# Altium project Merge.PrjPcb
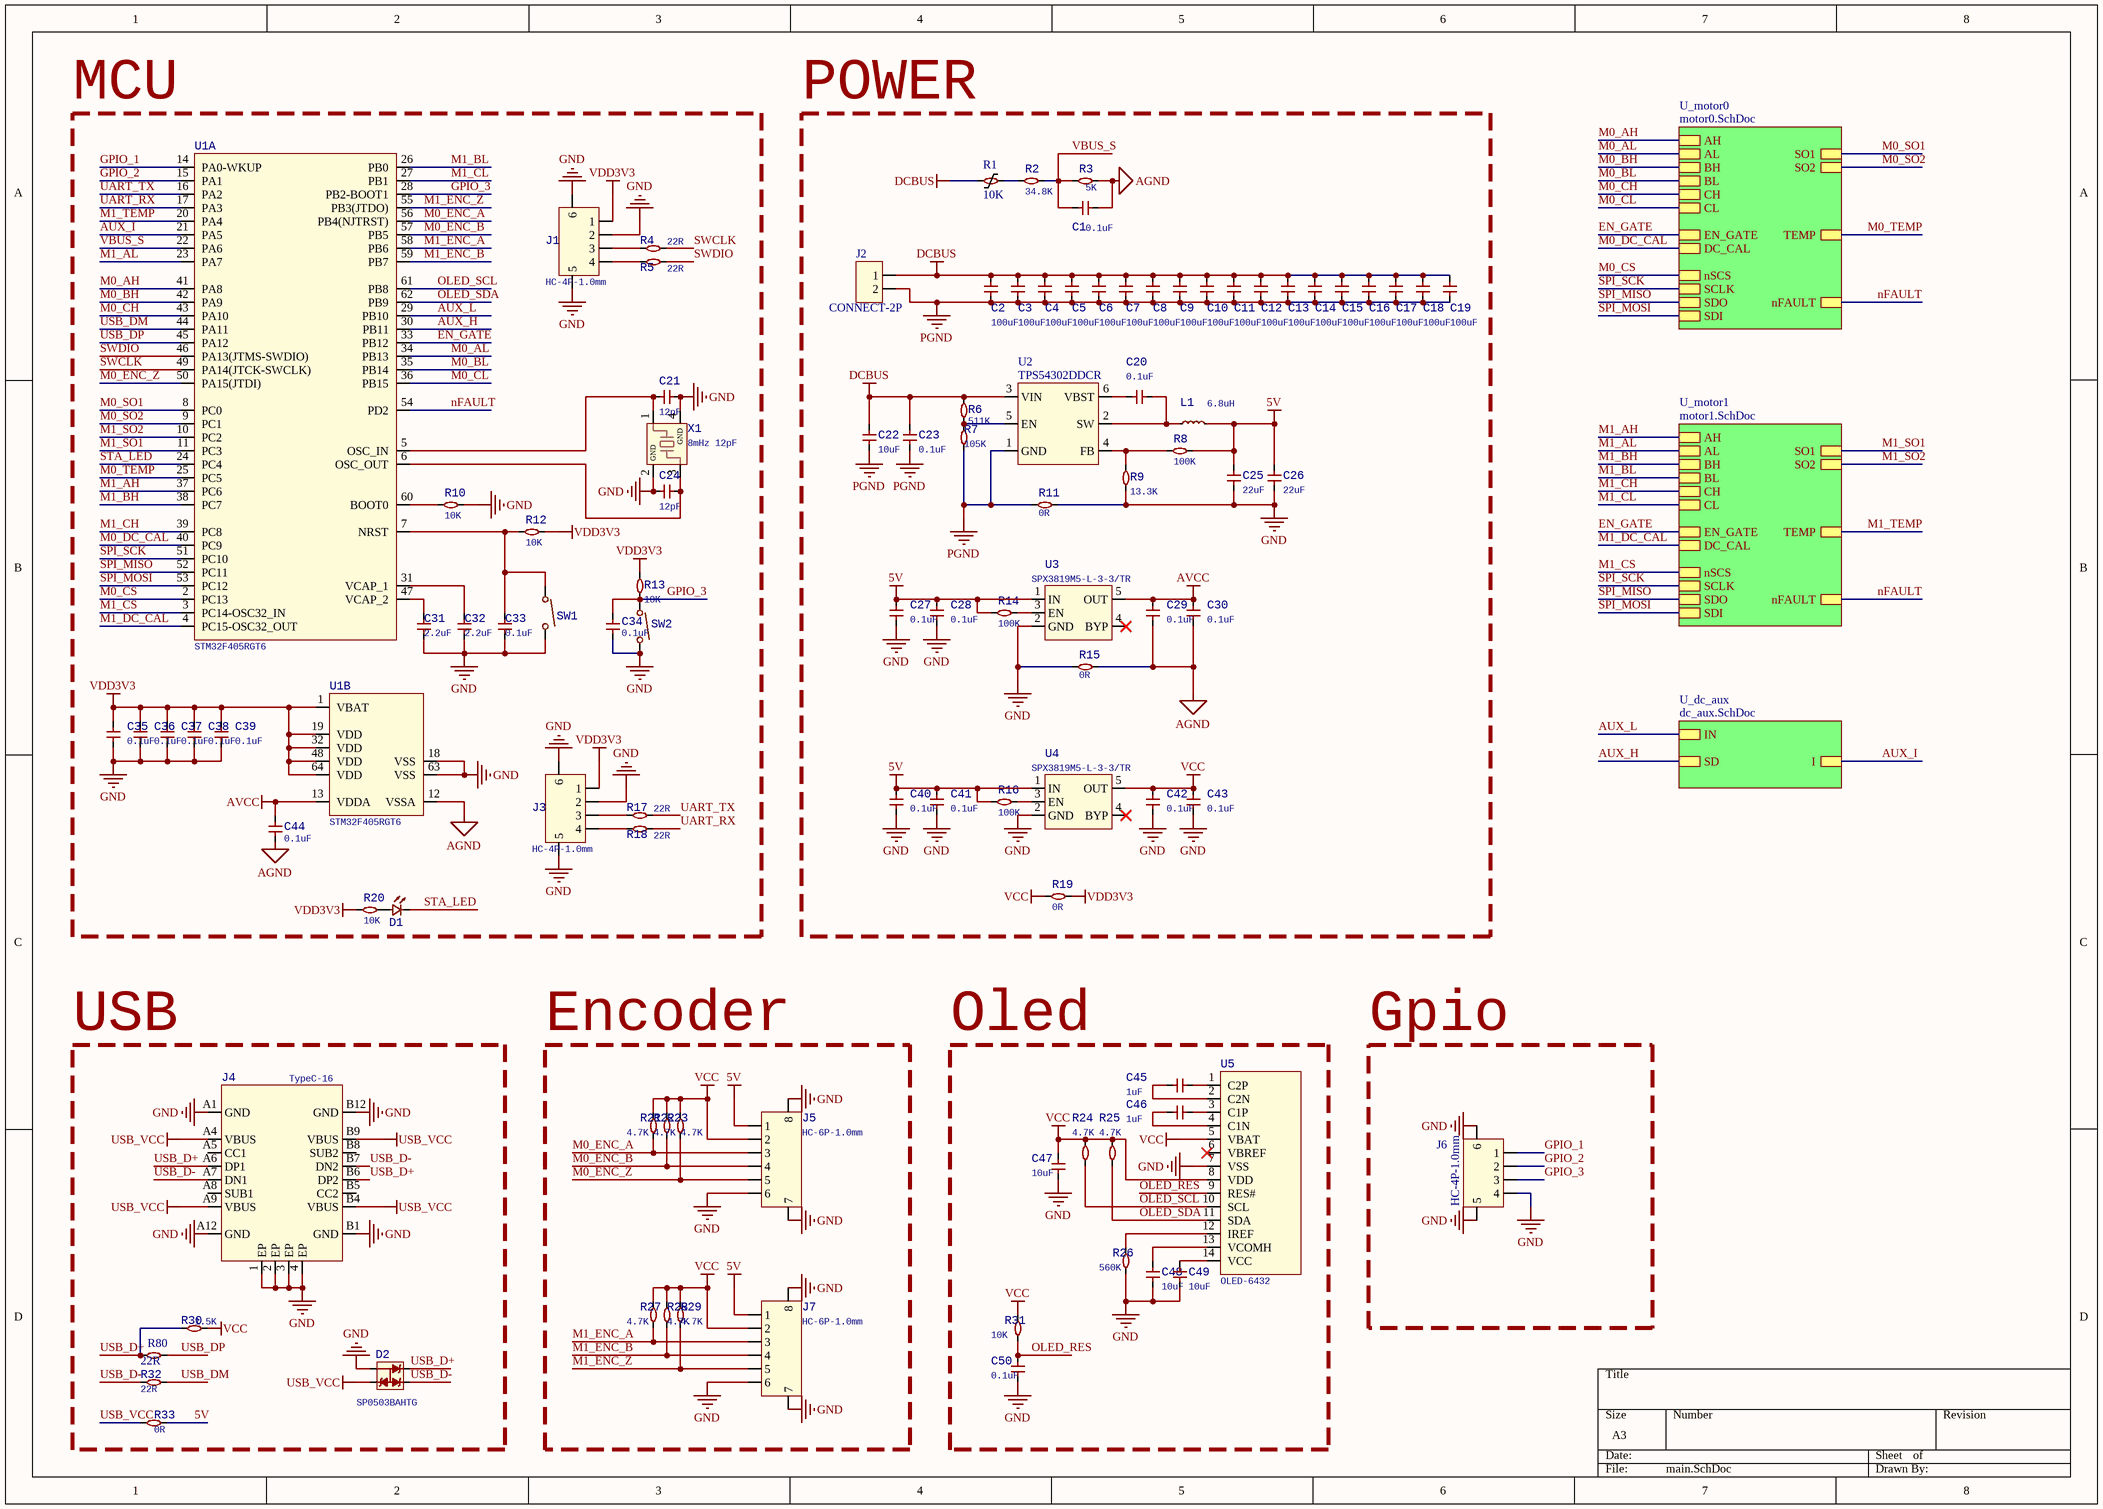
[diagram p0: main.SchDoc]
4 sheets, 219 parts. Net scope: hierarchical (ports join the sheet entries above them; power ports are global).
Board file: focDriver.PcbDoc
Sheets:
  main.SchDoc
    U_motor1 = motor1.SchDoc
    U_motor0 = motor0.SchDoc
    U_dc_aux = dc_aux.SchDoc

## Sheet main.SchDoc
size A3; SheetNumber: 1; SheetTotal: 4

### Parts
C1  0.1uF  [C0402]
C2  100uF  [C1206]
C3  100uF  [C1206]
C4  100uF  [C1206]
C5  100uF  [C1206]
C6  100uF  [C1206]
C7  100uF  [C1206]
C8  100uF  [C1206]
C9  100uF  [C1206]
C10  100uF  [C1206]
C11  100uF  [C1206]
C12  100uF  [C1206]
C13  100uF  [C1206]
C14  100uF  [C1206]
C15  100uF  [C1206]
C16  100uF  [C1206]
C17  100uF  [C1206]
C18  100uF  [C1206]
C19  100uF  [C1206]
C20  0.1uF  [C0402]
C21  12pF  [C0402]
C22  10uF  [C0402]
C23  0.1uF  [C0402]
C24  12pF  [C0402]
C25  22uF  [C0805]
C26  22uF  [C0805]
C27  0.1uF  [C0402]
C28  0.1uF  [C0402]
C29  0.1uF  [C0402]
C30  0.1uF  [C0402]
C31  2.2uF  [C0402]
C32  2.2uF  [C0402]
C33  0.1uF  [C0402]
C34  0.1uF  [C0402]
C35  0.1uF  [C0402]
C36  0.1uF  [C0402]
C37  0.1uF  [C0402]
C38  0.1uF  [C0402]
C39  0.1uF  [C0402]
C40  0.1uF  [C0402]
C41  0.1uF  [C0402]
C42  0.1uF  [C0402]
C43  0.1uF  [C0402]
C44  0.1uF  [C0402]
C45  1uF  [C0402]
C46  1uF  [C0402]
C47  10uF  [C0402]
C48  10uF  [C0402]
C49  10uF  [C0402]
C50  0.1uF  [C0402]
D1  LED  [LED-0402]  (value not drawn)
D2  SP0503BAHTG  [SOT-143]
J1  HC-4P-1.0mm  [SMD_4P_HC-1.0]
J2  CONNECT-2P  [CONNECT--EP-2P]
J3  HC-4P-1.0mm  [SMD_4P_HC-1.0]
J4  TypeC-16  [USB-SMD_TYPE-C-16P]
J5  HC-6P-1.0mm  [SMD_6P_HC-1.0]
J6  HC-4P-1.0mm  [SMD_4P_HC-1.0]
J7  HC-6P-1.0mm  [SMD_6P_HC-1.0]
L1  6.8uH  [L1008]
R1  10K  [R0402]
R2  34.8K  [R0402]
R3  5K  [R0402]
R4  22R  [R0402]
R5  22R  [R0402]
R6  511K  [R0402]
R7  105K  [R0402]
R8  100K  [R0402]
R9  13.3K  [R0402]
R10  10K  [R0402]
R11  0R  [R0402]
R12  10K  [R0402]
R13  10K  [R0402]
R14  100K  [R0402]
R15  0R  [R0402]
R16  100K  [R0402]
R17  22R  [R0402]
R18  22R  [R0402]
R19  0R  [R0402]
R20  10K  [R0402]
R21  4.7K  [R0402]
R22  4.7K  [R0402]
R23  4.7K  [R0402]
R24  4.7K  [R0402]
R25  4.7K  [R0402]
R26  560K  [R0402]
R27  4.7K  [R0402]
R28  4.7K  [R0402]
R29  4.7K  [R0402]
R30  1.5K  [R0402]
R31  10K  [R0402]
R32  22R  [R0402]
R33  0R  [R0402]
R80  22R  [R0402]
SW1  3*4两脚按键  [SW-SMD_L4.0-W2.9]  (value not drawn)
SW2  3*4两脚按键  [SW-SMD_L4.0-W2.9]  (value not drawn)
U1  STM32F405RGT6  [LQFP-64_L10.0-W10.0-P0.50]  (parts A,B of 2)
U2  TPS54302DDCR  [SOT-23-6]
U3  SPX3819M5-L-3-3/TR  [SOT-23-5]
U4  SPX3819M5-L-3-3/TR  [SOT-23-5]
U5  OLED-6432  [OLED-0.96-128x64]
X1  8mHz 12pF  [SMD2016-4P]

### Blocks framed on the sheet
MCU: C21 C24 C31-C39 C44 D1 J1 J3 R4 R5 R10 R12 R13 R17 R18 R20 SW1 SW2 U1 X1
POWER: C1-C20 C22 C23 C25-C30 C40-C43 J2 L1 R1-R3 R6-R9 R11 R14-R16 R19 U2-U4
USB: D2 J4 R30 R32 R33 R80
Encoder: J5 J7 R21-R23 R27-R29
Oled: C45-C50 R24-R26 R31 U5
Gpio: J6

### Sub-sheets
U_dc_aux = dc_aux.SchDoc: IN, SD, I
U_motor0 = motor0.SchDoc: SO2, CL, SO1, CH, BL, BH, AL, AH, EN_GATE, DC_CAL, SCLK, SDO, SDI, nSCS, nFAULT, TEMP
U_motor1 = motor1.SchDoc: SO2, CL, SO1, CH, BL, BH, AL, AH, EN_GATE, DC_CAL, SCLK, SDO, SDI, nSCS, nFAULT, TEMP

### Nets
5V: C25.1 C26.1 C27.1 C28.1 C40.1 C41.1 J5.1 J7.1 L1.2 R8.2 R14.2 R16.2 R33.2 U3.1(IN) U4.1(IN)
AGND: C1.2 C29.2 C30.2 C44.2 R3.1 R15.1 U1.12(VSSA)
AVCC: C29.1 C30.1 C44.1 U1.13(VDDA) U3.5(OUT)
DCBUS: C2.1 C3.1 C4.1 C5.1 C6.1 C7.1 C8.1 C9.1 C10.1 C11.1 C12.1 C13.1 C14.1 C15.1 C16.1 C17.1 C18.1 C19.1 C22.1 C23.1 J2.1 R1.2 R6.2 U2.3(VIN)
GND: C21.2 C24.2 C25.2 C26.2 C27.2 C28.2 C31.2 C32.2 C33.1 C34.1 C35.2 C36.2 C37.2 C38.2 C39.2 C40.2 C41.2 C42.2 C43.2 C47.2 C48.2 C49.2 C50.2 D2.1 J1.2 J1.5 J1.6 J3.2 J3.5 J3.6 J4.1(EP) J4.2(EP) J4.3(EP) J4.4(EP) J4.A1(GND) J4.A12(GND) J4.B1(GND) J4.B12(GND) J5.6 J5.7 J5.8 J6.4 J6.5 J6.6 J7.6 J7.7 J7.8 R9.1 R10.2 R11.1 R15.2 R26.1 SW1.2 SW2.2 U1.18(VSS) U1.63(VSS) U3.2(GND) U4.2(GND) U5.7(VSS) X1.2(GND) X1.4(GND)
PGND: C2.2 C3.2 C4.2 C5.2 C6.2 C7.2 C8.2 C9.2 C10.2 C11.2 C12.2 C13.2 C14.2 C15.2 C16.2 C17.2 C18.2 C19.2 C22.2 C23.2 J2.2 R7.2 R11.2 U2.1(GND)
USB_VCC: D2.2 J4.A4(VBUS) J4.A9(VBUS) J4.B4(VBUS) J4.B9(VBUS) R33.1
VCC: C42.1 C43.1 C47.1 J5.2 J7.2 R19.1 R21.2 R22.2 R23.2 R24.2 R25.2 R27.2 R28.2 R29.2 R30.2 R31.2 U4.5(OUT) U5.5(VBAT) U5.8(VDD)
VDD3V3: C35.1 C36.1 C37.1 C38.1 C39.1 J1.1 J3.1 R12.2 R13.2 R19.2 R20.1 U1.1(VBAT) U1.19(VDD) U1.32(VDD) U1.48(VDD) U1.64(VDD)
AUX_H: U1.30(PB11) ; sheet U_dc_aux/SD
AUX_I: U1.21(PA5) ; sheet U_dc_aux/I
AUX_L: U1.29(PB10) ; sheet U_dc_aux/IN
EN_GATE: U1.33(PB12) ; sheet U_motor1/EN_GATE, sheet U_motor0/EN_GATE
GPIO_1: J6.1 U1.14(PA0-WKUP)
GPIO_2: J6.2 U1.15(PA1)
GPIO_3: C34.2 J6.3 R13.1 SW2.1 U1.28(PB2-BOOT1)
M0_AH: U1.41(PA8) ; sheet U_motor0/AH
M0_AL: U1.34(PB13) ; sheet U_motor0/AL
M0_BH: U1.42(PA9) ; sheet U_motor0/BH
M0_BL: U1.35(PB14) ; sheet U_motor0/BL
M0_CH: U1.43(PA10) ; sheet U_motor0/CH
M0_CL: U1.36(PB15) ; sheet U_motor0/CL
M0_CS: U1.2(PC13) ; sheet U_motor0/nSCS
M0_DC_CAL: U1.40(PC9) ; sheet U_motor0/DC_CAL
M0_ENC_A: J5.3 R21.1 U1.56(PB4(NJTRST))
M0_ENC_B: J5.4 R22.1 U1.57(PB5)
M0_ENC_Z: J5.5 R23.1 U1.50(PA15(JTDI))
M0_SO1: U1.8(PC0) ; sheet U_motor0/SO1
M0_SO2: U1.9(PC1) ; sheet U_motor0/SO2
M0_TEMP: U1.25(PC5) ; sheet U_motor0/TEMP
M1_AH: U1.37(PC6) ; sheet U_motor1/AH
M1_AL: U1.23(PA7) ; sheet U_motor1/AL
M1_BH: U1.38(PC7) ; sheet U_motor1/BH
M1_BL: U1.26(PB0) ; sheet U_motor1/BL
M1_CH: U1.39(PC8) ; sheet U_motor1/CH
M1_CL: U1.27(PB1) ; sheet U_motor1/CL
M1_CS: U1.3(PC14-OSC32_IN) ; sheet U_motor1/nSCS
M1_DC_CAL: U1.4(PC15-OSC32_OUT) ; sheet U_motor1/DC_CAL
M1_ENC_A: J7.3 R27.1 U1.58(PB6)
M1_ENC_B: J7.4 R28.1 U1.59(PB7)
M1_ENC_Z: J7.5 R29.1 U1.55(PB3(JTDO))
M1_SO1: U1.11(PC3) ; sheet U_motor1/SO1
M1_SO2: U1.10(PC2) ; sheet U_motor1/SO2
M1_TEMP: U1.20(PA4) ; sheet U_motor1/TEMP
nFAULT: U1.54(PD2) ; sheet U_motor1/nFAULT, sheet U_motor0/nFAULT
OLED_RES: C50.1 R31.1 U5.9(RES#)
OLED_SCL: R24.1 U1.61(PB8) U5.10(SCL)
OLED_SDA: R25.1 U1.62(PB9) U5.11(SDA)
SPI_MISO: U1.52(PC11) ; sheet U_motor1/SDO, sheet U_motor0/SDO
SPI_MOSI: U1.53(PC12) ; sheet U_motor1/SDI, sheet U_motor0/SDI
SPI_SCK: U1.51(PC10) ; sheet U_motor1/SCLK, sheet U_motor0/SCLK
STA_LED: D1.1 U1.24(PC4)
SWCLK: R4.2 U1.49(PA14(JTCK-SWCLK))
SWDIO: R5.2 U1.46(PA13(JTMS-SWDIO))
UART_RX: R18.2 U1.17(PA3)
UART_TX: R17.2 U1.16(PA2)
USB_D+: D2.4 J4.A6(DP1) J4.B6(DP2) R30.1 R80.1
USB_D-: D2.3 J4.A7(DN1) J4.B7(DN2) R32.1
USB_DM: R32.2 U1.44(PA11)
USB_DP: R80.2 U1.45(PA12)
VBUS_S: C1.1 R2.1 R3.2 U1.22(PA6)
NetC20_1: C20.1 L1.1 U2.2(SW)
NetC20_2: C20.2 U2.6(VBST)
NetC21_1: C21.1 U1.5(OSC_IN) X1.1
NetC24_1: C24.1 U1.6(OSC_OUT) X1.3
NetC31_1: C31.1 U1.47(VCAP_2)
NetC32_1: C32.1 U1.31(VCAP_1)
NetC33_2: C33.2 R12.1 SW1.1 U1.7(NRST)
NetC45_1: C45.1 U5.1(C2P)
NetC45_2: C45.2 U5.2(C2N)
NetC46_1: C46.1 U5.3(C1P)
NetC46_2: C46.2 U5.4(C1N)
NetC48_1: C48.1 U5.13(VCOMH)
NetC49_1: C49.1 U5.14(VCC)
NetD1_2: D1.2 R20.2
NetJ1_3: J1.3 R4.1
NetJ1_4: J1.4 R5.1
NetJ3_3: J3.3 R17.1
NetJ3_4: J3.4 R18.1
NetR1_1: R1.1 R2.2
NetR6_1: R6.1 R7.1 U2.5(EN)
NetR8_1: R8.1 R9.2 U2.4(FB)
NetR10_1: R10.1 U1.60(BOOT0)
NetR14_1: R14.1 U3.3(EN)
NetR16_1: R16.1 U4.3(EN)
NetR26_2: R26.2 U5.12(IREF)

Not connected (* = marked no-connect by the designer): J4 A5(CC1) A8(SUB1) B5(CC2) B8(SUB2); U3 4(BYP)*; U4 4(BYP)*; U5 6(VBREF)*

### Library data of the parts
C1-C50 = CAP: 贴片电容; Manufacturer: SAMSUNG(三星); Manufacturer Part: CL05A105KP5NNND; Add into BOM: yes; Tolerance: ±10%; Voltage Rated: 10V; Temperature Coefficient: X5R; Symbol: CAP-0402; Device: cap-0402; LCSC Part Name: 1uF ±10% 10V; Supplier Part: C307414; Supplier Footprint: 0402; JLCPCB Part Class: Extended Part; Datasheet: https://atta.szlcsc.com/upload/public/pdf/source/20181009/C307414_0A02B57115E94FED95F0CB1E32115BFC.pdf; Supplier: LCSC; Convert to PCB: yes
D1 = LED: 贴片发光二极管; Manufacturer: SAMSUNG(三星); Manufacturer Part: CL05A105KP5NNND; Add into BOM: yes; Tolerance: ±10%; Voltage Rated: 10V; Temperature Coefficient: X5R; Symbol: CAP-0402; Device: cap-0402; LCSC Part Name: 1uF ±10% 10V; Supplier Part: C307414; Supplier Footprint: 0402; JLCPCB Part Class: Extended Part; Datasheet: https://atta.szlcsc.com/upload/public/pdf/source/20181009/C307414_0A02B57115E94FED95F0CB1E32115BFC.pdf; Supplier: LCSC; Convert to PCB: yes
D2 = SP0503BAHTG: USB-三组 瞬态移植二极管
J1 J3 J6 = HC-4P-1.0mm: 线对板连接器
J2 = CONNECT-2P: 连接器
J4 = TypeC-16P: Type-C母座; 触点数量:16; Manufacturer: kinghelm(金航标); Symbol: KH-TYPE-C-16P; Add into BOM: yes; Connector Type: Type-C; Gender: 母座; Number of Contacts: 16; Number of Ports: 1; Current Rating - Power (Max): 3A; LCSC Part Name: Type-C 母座 卧贴; Supplier Part: C709357; Manufacturer Part: KH-TYPE-C-16P; Supplier Footprint: SMD; Datasheet: https://atta.szlcsc.com/upload/public/pdf/source/20200911/C709357_AA8DCEB38BB20E3035A7ED7AE7667837.pdf; Supplier: LCSC; Convert to PCB: yes; Standard: -; Mounting Style: 卧贴; Operating Temperature Range: -40~+85; JLCPCB Part Class: Extended Part
J5 J7 = HC-6P-1.0mm: 线对板连接器
L1 = IND: 贴片电感
R1 = NTC: 热敏电阻; Manufacturer: UNI-ROYAL(厚声); Manufacturer Part: 0402WGF1001TCE; Add into BOM: yes; Tolerance: ±1%; Power(Watts): 1/16W; Temperature Coefficient: ±100ppm/; Overload Voltage (Max): 50V; Symbol: RES-0402; Device: res-0402; LCSC Part Name: 1k ±1%; Supplier Part: C11702; Supplier Footprint: 0402; Datasheet: https://atta.szlcsc.com/upload/public/pdf/source/20200306/C422600_1E6D84923E4A46A82E41ADD87F860B5C.pdf; Supplier: LCSC; Convert to PCB: yes; Type: 厚膜电阻; Operating Temperature Range: -55~+155; JLCPCB Part Class: 基础库
R2-R33 R80 = RES: 贴片电阻; Manufacturer: UNI-ROYAL(厚声); Manufacturer Part: 0402WGF1001TCE; Add into BOM: yes; Tolerance: ±1%; Power(Watts): 1/16W; Temperature Coefficient: ±100ppm/; Overload Voltage (Max): 50V; Symbol: RES-0402; Device: res-0402; LCSC Part Name: 1k ±1%; Supplier Part: C11702; Supplier Footprint: 0402; Datasheet: https://atta.szlcsc.com/upload/public/pdf/source/20200306/C422600_1E6D84923E4A46A82E41ADD87F860B5C.pdf; Supplier: LCSC; Convert to PCB: yes; Type: 厚膜电阻; Operating Temperature Range: -55~+155; JLCPCB Part Class: 基础库
SW1 SW2 = Switch: 3*4两脚贴片不带柱; Manufacturer: BRIGHT(博瑞泰); Symbol: TSA343G00-250J2; Device: 3*4两脚按键不带柱; Add into BOM: yes; Contact Current: 50mA; Voltage Rating (DC): 12V; Insulation Resistance: 100M; Circuit: 单刀单掷; Actuator Style: 圆形按钮; Actuator/Cap Color: 黑色; With Lamp: 无; Operating Force: 250gf@±50gf; Mechanical Life: 50000; Pin Style: SMD接片; Switch Length: 3.95mm; Switch Width: 2.9mm; Switch Height: 2mm; Strike Gundam: 否; LCSC Part Name: 3*4 两脚小龟不带柱  250gf; Supplier Part: C354946; Manufacturer Part: TSA343G00-250J2; Supplier Footprint: SMD; Datasheet: https://atta.szlcsc.com/upload/public/pdf/source/20190426/C354946_6B70DFBDFA823D17B8EB46FB9599F693.pdf; Supplier: LCSC; Convert to PCB: yes; Mounting Style: 立贴; Operating Temperature: -25~+70; JLCPCB Part Class: Extended Part
U1 = STM32F405RGT6: ST,MCU,CPU内核：ARM Cortex-M4 CPU最大主频：168MHz 程序存储容量：512KB 程序存储器类型：FLASH RAM总容量：192KB
U2 = TPS54302DDCR: 降压DCDC / 输入4.5~28V / 输出596mV~28V / 3A
U3 U4 = SPX3819M5-L-3-3/TR: LDO输入电压:16V;输出电压:3.3V; Manufacturer: MaxLinear; Add into BOM: yes; Output Type: 固定; Output Polarity: 正; Number of Outputs: 1; Maximum Input Voltage: 16V; Output Voltage: 3.3V; Dropout Voltage: 700mV@(500mA); Output Current: 500mA; Power Supply Rejection Ratio (PRSS): 70dB; Symbol: SPX3819M5-L-3-3/TR; LCSC Part Name: Vin=16V Vout=3.3V 500mA 70dB; Supplier Part: C9055; Manufacturer Part: SPX3819M5-L-3-3/TR; Supplier Footprint: SOT-23-5; Datasheet: https://atta.szlcsc.com/upload/public/pdf/source/20160421/1461205045150.pdf; Supplier: LCSC; Convert to PCB: yes; JLCPCB Part Class: Extended Part
U5 = OLED
X1 = XTAL: 无源晶振  频率公差：±10ppm

## Sheet motor1.SchDoc
size A4; SheetNumber: 3; SheetTotal: 4
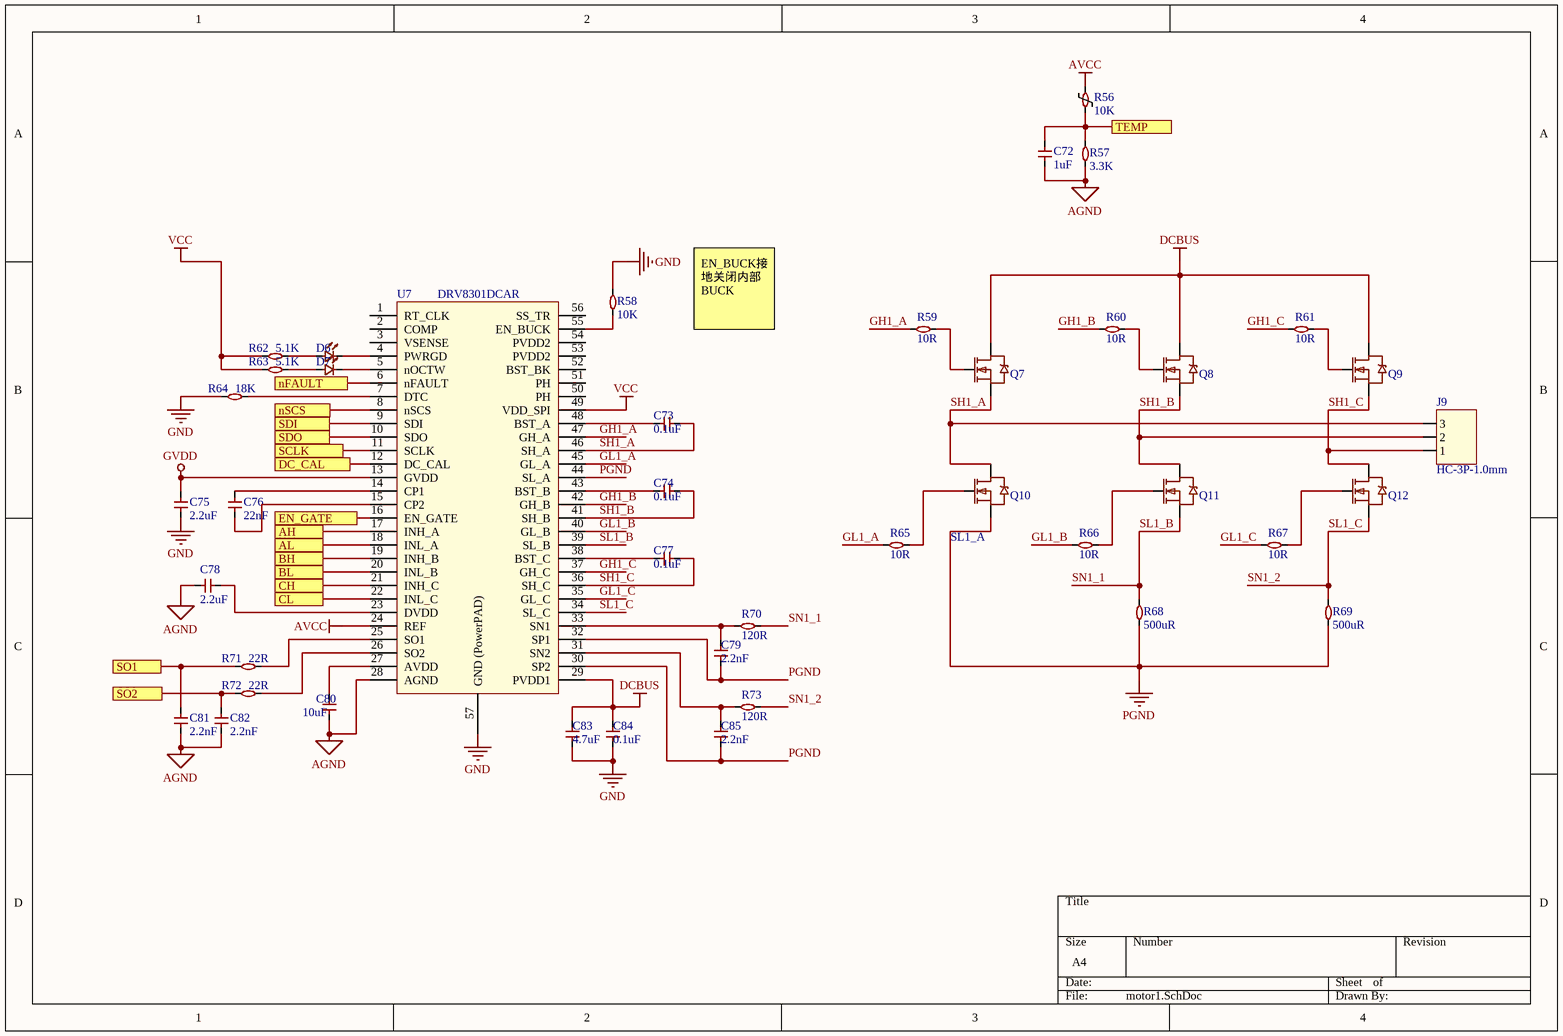
[diagram p1: motor1.SchDoc]

### Parts
C72  1uF  [C0402]
C73  0.1uF  [C0402]
C74  0.1uF  [C0402]
C75  2.2uF  [C0402]
C76  22nF  [C0402]
C77  0.1uF  [C0402]
C78  2.2uF  [C0402]
C79  2.2nF  [C0402]
C80  10uF  [C0402]
C81  2.2nF  [C0402]
C82  2.2nF  [C0402]
C83  4.7uF  [C0402]
C84  0.1uF  [C0402]
C85  2.2nF  [C0402]
D6  LED  [LED-0402]  (value not drawn)
D7  LED  [LED-0402]  (value not drawn)
J9  HC-3P-1.0mm  [AMASS-MR30-M]
Q7  AP68N06G  [TDSON-8_L5.0-W6.0-3PIN]  (value not drawn)
Q8  AP68N06G  [TDSON-8_L5.0-W6.0-3PIN]  (value not drawn)
Q9  AP68N06G  [TDSON-8_L5.0-W6.0-3PIN]  (value not drawn)
Q10  AP68N06G  [TDSON-8_L5.0-W6.0-3PIN]  (value not drawn)
Q11  AP68N06G  [TDSON-8_L5.0-W6.0-3PIN]  (value not drawn)
Q12  AP68N06G  [TDSON-8_L5.0-W6.0-3PIN]  (value not drawn)
R56  10K  [R0402]
R57  3.3K  [R0402]
R58  10K  [R0402]
R59  10R  [R0402]
R60  10R  [R0402]
R61  10R  [R0402]
R62  5.1K  [R0402]
R63  5.1K  [R0402]
R64  18K  [R0402]
R65  10R  [R0402]
R66  10R  [R0402]
R67  10R  [R0402]
R68  500uR  [R2512]
R69  500uR  [R2512]
R70  120R  [R0402]
R71  22R  [R0402]
R72  22R  [R0402]
R73  120R  [R0402]
U7  DRV8301DCAR  [HTSSOP-56_L14.0-W6.0-P0.50]

### Ports
AH (see main[7B]), AL (see main[7B]), BH (see main[7B]), BL (see main[7B]), CH (see main[7B]), CL (see main[7B]), DC_CAL (see main[7B]), EN_GATE (see main[7B], motor0[1C]), nFAULT (see main[8B], motor0[1B]), nSCS (see main[7B]), SCLK (see main[7B], motor0[1B]), SDI (see main[7B], motor0[1B]), SDO (see main[7B], motor0[1B]), SO1 (see main[8B]), SO2 (see main[8B]), TEMP (see main[8B])

### Nets
AGND: C72.2 C78.1 C80.2 C81.2 C82.2 R57.1 U7.28(AGND)
AVCC: R56.2 U7.24(REF)
DCBUS: C83.1 C84.1 Q7.3(D) Q8.3(D) Q9.3(D) U7.29(PVDD1)
GND: C75.1 C83.2 C84.2 R58.2 R64.1 U7.57(GND_(PowerPAD))
GVDD: C75.2 U7.13(GVDD)
PGND: C79.2 C85.2 Q10.2(S) R68.2 R69.2 U7.30(SP2) U7.32(SP1) U7.44(SL_A)
VCC: R62.1 R63.1 U7.49(VDD_SPI)
EN_GATE: U7.16(EN_GATE) ; port EN_GATE
GH1_A: R59.2 U7.47(GH_A)
GH1_B: R60.2 U7.42(GH_B)
GH1_C: R61.2 U7.37(GH_C)
GL1_A: R65.2 U7.45(GL_A)
GL1_B: R66.2 U7.40(GL_B)
GL1_C: R67.2 U7.35(GL_C)
M1_AH: U7.17(INH_A) ; port AH
M1_AL: U7.18(INL_A) ; port AL
M1_BH: U7.19(INH_B) ; port BH
M1_BL: U7.20(INL_B) ; port BL
M1_CH: U7.21(INH_C) ; port CH
M1_CL: U7.22(INL_C) ; port CL
M1_CS: U7.8(nSCS) ; port nSCS
M1_DC_CAL: U7.12(DC_CAL) ; port DC_CAL
M1_SO1: C81.1 R71.1 ; port SO1
M1_SO2: C82.1 R72.1 ; port SO2
M1_TEMP: C72.1 R56.1 R57.2 ; port TEMP
nFAULT: U7.6(nFAULT) ; port nFAULT
SH1_A: C73.2 J9.3 Q7.2(S) Q10.3(D) U7.46(SH_A)
SH1_B: C74.2 J9.2 Q8.2(S) Q11.3(D) U7.41(SH_B)
SH1_C: C77.2 J9.1 Q9.2(S) Q12.3(D) U7.36(SH_C)
SL1_B: Q11.2(S) R68.1 R70.2 U7.39(SL_B)  [also labelled SN1_1]
SL1_C: Q12.2(S) R69.1 R73.2 U7.34(SL_C)  [also labelled SN1_2]
SPI_MISO: U7.10(SDO) ; port SDO
SPI_MOSI: U7.9(SDI) ; port SDI
SPI_SCK: U7.11(SCLK) ; port SCLK
NetC73_1: C73.1 U7.48(BST_A)
NetC74_1: C74.1 U7.43(BST_B)
NetC76_1: C76.1 U7.15(CP2)
NetC76_2: C76.2 U7.14(CP1)
NetC77_1: C77.1 U7.38(BST_C)
NetC78_2: C78.2 U7.23(DVDD)
NetC79_1: C79.1 R70.1 U7.33(SN1)
NetC80_1: C80.1 U7.27(AVDD)
NetC85_1: C85.1 R73.1 U7.31(SN2)
NetD6_1: D6.1 U7.4(PWRGD)
NetD6_2: D6.2 R62.2
NetD7_1: D7.1 U7.5(nOCTW)
NetD7_2: D7.2 R63.2
NetQ7_1: Q7.1(G) R59.1
NetQ8_1: Q8.1(G) R60.1
NetQ9_1: Q9.1(G) R61.1
NetQ10_1: Q10.1(G) R65.1
NetQ11_1: Q11.1(G) R66.1
NetQ12_1: Q12.1(G) R67.1
NetR58_1: R58.1 U7.55(EN_BUCK)
NetR64_2: R64.2 U7.7(DTC)
NetR71_2: R71.2 U7.25(SO1)
NetR72_2: R72.2 U7.26(SO2)

Not connected (* = marked no-connect by the designer): U7 1(RT_CLK) 2(COMP) 3(VSENSE) 50(PH) 51(PH) 52(BST_BK) 53(PVDD2) 54(PVDD2) 56(SS_TR)

### Notes on the sheet
- EN_BUCK接地关闭内部BUCK
- (near Q10) SL1_A

### Library data of the parts
C72-C85 = CAP: as C1 on sheet main; Symbol: CAP-0402; Device: cap-0402; LCSC Part Name: 1uF ±10% 10V; Supplier Part: C307414; Supplier Footprint: 0402; JLCPCB Part Class: Extended Part; Datasheet: https://atta.szlcsc.com/upload/public/pdf/source/20181009/C307414_0A02B57115E94FED95F0CB1E32115BFC.pdf; Supplier: LCSC; Convert to PCB: yes
D6 D7 = LED: as D1 on sheet main; Symbol: CAP-0402; Device: cap-0402; LCSC Part Name: 1uF ±10% 10V; Supplier Part: C307414; Supplier Footprint: 0402; JLCPCB Part Class: Extended Part; Datasheet: https://atta.szlcsc.com/upload/public/pdf/source/20181009/C307414_0A02B57115E94FED95F0CB1E32115BFC.pdf; Supplier: LCSC; Convert to PCB: yes
J9 = HC-3P-1.0mm: 线对板连接器
Q7-Q12 = NMOS: N沟道功率mos管; Manufacturer: BORN(伯恩半导体); Name: AO3401A; Symbol: AO3401A_C306862; Add into BOM: yes; Type: P沟道; Drain Source Voltage (Vdss): 30V; Continuous Drain Current (Id): 4.2A; Power Dissipation (Pd): 1.4W; Drain Source On Resistance (RDS(on)@Vgs,Id): 50mΩ@10V,4.1A; Gate Threshold Voltage (Vgs(th)@Id): 2V@250uA; Device: AO3401A_C306862; LCSC Part Name: P沟道 30V 4.2A; Supplier Part: C306862; Manufacturer Part: AO3401A; Supplier Footprint: SOT-23; JLCPCB Part Class: 扩展库; Datasheet: https://atta.szlcsc.com/upload/public/pdf/source/20190514/C306862_F7EF2FFF49BA48EA0D342955B5285B33.pdf; Supplier: LCSC; Convert to PCB: yes
R56 = NTC: as R1 on sheet main; Symbol: RES-0402; Device: res-0402; LCSC Part Name: 1k ±1%; Supplier Part: C11702; Supplier Footprint: 0402; Datasheet: https://atta.szlcsc.com/upload/public/pdf/source/20200306/C422600_1E6D84923E4A46A82E41ADD87F860B5C.pdf; Supplier: LCSC; Convert to PCB: yes; Type: 厚膜电阻; Operating Temperature Range: -55~+155; JLCPCB Part Class: 基础库
R57-R73 = RES: as R2 on sheet main; Symbol: RES-0402; Device: res-0402; LCSC Part Name: 1k ±1%; Supplier Part: C11702; Supplier Footprint: 0402; Datasheet: https://atta.szlcsc.com/upload/public/pdf/source/20200306/C422600_1E6D84923E4A46A82E41ADD87F860B5C.pdf; Supplier: LCSC; Convert to PCB: yes; Type: 厚膜电阻; Operating Temperature Range: -55~+155; JLCPCB Part Class: 基础库
U7 = DRV8301DCAR: 三相电机/栅极驱动IC

## Sheet motor0.SchDoc
size A4; SheetNumber: 2; SheetTotal: 4
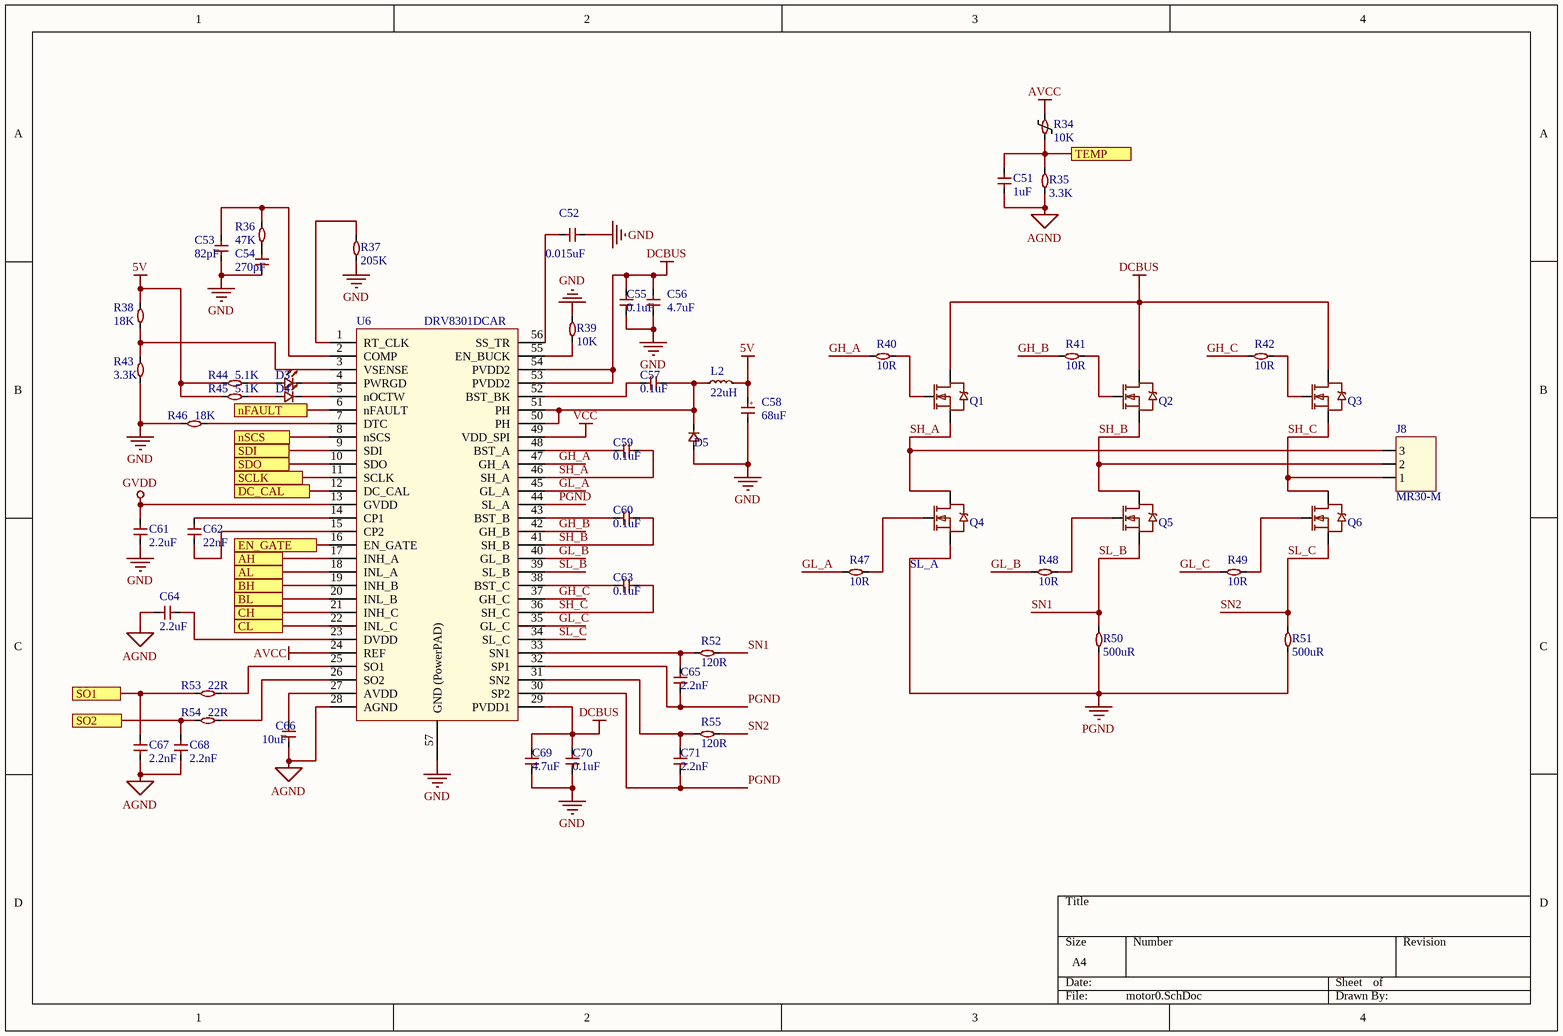
[diagram p2: motor0.SchDoc]

### Parts
C51  1uF  [C0402]
C52  0.015uF  [C0402]
C53  82pF  [C0402]
C54  270pF  [C0402]
C55  0.1uF  [C0402]
C56  4.7uF  [C0402]
C57  0.1uF  [C0402]
C58  68uF  [C1206]
C59  0.1uF  [C0402]
C60  0.1uF  [C0402]
C61  2.2uF  [C0402]
C62  22nF  [C0402]
C63  0.1uF  [C0402]
C64  2.2uF  [C0402]
C65  2.2nF  [C0402]
C66  10uF  [C0402]
C67  2.2nF  [C0402]
C68  2.2nF  [C0402]
C69  4.7uF  [C0402]
C70  0.1uF  [C0402]
C71  2.2nF  [C0402]
D3  LED  [LED-0402]  (value not drawn)
D4  LED  [LED-0402]  (value not drawn)
D5  MBR0540  [SOD-323]  (value not drawn)
J8  MR30-M  [AMASS-MR30-M]
L2  22uH  [L1008]
Q1  AP68N06G  [TDSON-8_L5.0-W6.0-3PIN]  (value not drawn)
Q2  AP68N06G  [TDSON-8_L5.0-W6.0-3PIN]  (value not drawn)
Q3  AP68N06G  [TDSON-8_L5.0-W6.0-3PIN]  (value not drawn)
Q4  AP68N06G  [TDSON-8_L5.0-W6.0-3PIN]  (value not drawn)
Q5  AP68N06G  [TDSON-8_L5.0-W6.0-3PIN]  (value not drawn)
Q6  AP68N06G  [TDSON-8_L5.0-W6.0-3PIN]  (value not drawn)
R34  10K  [R0402]
R35  3.3K  [R0402]
R36  47K  [R0402]
R37  205K  [R0402]
R38  18K  [R0402]
R39  10K  [R0402]
R40  10R  [R0402]
R41  10R  [R0402]
R42  10R  [R0402]
R43  3.3K  [R0402]
R44  5.1K  [R0402]
R45  5.1K  [R0402]
R46  18K  [R0402]
R47  10R  [R0402]
R48  10R  [R0402]
R49  10R  [R0402]
R50  500uR  [R2512]
R51  500uR  [R2512]
R52  120R  [R0402]
R53  22R  [R0402]
R54  22R  [R0402]
R55  120R  [R0402]
U6  DRV8301DCAR  [HTSSOP-56_L14.0-W6.0-P0.50]

### Ports
AH (see main[7A]), AL (see main[7A]), BH (see main[7A]), BL (see main[7A]), CH (see main[7A]), CL (see main[7A]), DC_CAL (see main[7A]), EN_GATE (see main[7A], motor1[1C]), nFAULT (see main[8A], motor1[1B]), nSCS (see main[7A]), SCLK (see main[7A], motor1[1B]), SDI (see main[7A], motor1[1B]), SDO (see main[7A], motor1[1B]), SO1 (see main[8A]), SO2 (see main[8A]), TEMP (see main[8A])

### Nets
5V: C58.1 L2.2 R38.2 R44.1 R45.1
AGND: C51.2 C64.1 C66.2 C67.2 C68.2 R35.1 U6.28(AGND)
AVCC: R34.2 U6.24(REF)
DCBUS: C55.1 C56.1 C69.1 C70.1 Q1.3(D) Q2.3(D) Q3.3(D) U6.29(PVDD1) U6.53(PVDD2) U6.54(PVDD2)
GND: C52.2 C53.1 C54.1 C55.2 C56.2 C58.2 C61.1 C69.2 C70.2 D5.2 R37.2 R39.2 R43.1 R46.1 U6.57(GND_(PowerPAD))
GVDD: C61.2 U6.13(GVDD)
PGND: C65.2 C71.2 Q4.2(S) R50.2 R51.2 U6.30(SP2) U6.32(SP1) U6.44(SL_A)
VCC: U6.49(VDD_SPI)
EN_GATE: U6.16(EN_GATE) ; port EN_GATE
GH_A: R40.2 U6.47(GH_A)
GH_B: R41.2 U6.42(GH_B)
GH_C: R42.2 U6.37(GH_C)
GL_A: R47.2 U6.45(GL_A)
GL_B: R48.2 U6.40(GL_B)
GL_C: R49.2 U6.35(GL_C)
M0_AH: U6.17(INH_A) ; port AH
M0_AL: U6.18(INL_A) ; port AL
M0_BH: U6.19(INH_B) ; port BH
M0_BL: U6.20(INL_B) ; port BL
M0_CH: U6.21(INH_C) ; port CH
M0_CL: U6.22(INL_C) ; port CL
M0_CS: U6.8(nSCS) ; port nSCS
M0_DC_CAL: U6.12(DC_CAL) ; port DC_CAL
M0_SO1: C67.1 R53.1 ; port SO1
M0_SO2: C68.1 R54.1 ; port SO2
M0_TEMP: C51.1 R34.1 R35.2 ; port TEMP
nFAULT: U6.6(nFAULT) ; port nFAULT
SH_A: C59.2 J8.3 Q1.2(S) Q4.3(D) U6.46(SH_A)
SH_B: C60.2 J8.2 Q2.2(S) Q5.3(D) U6.41(SH_B)
SH_C: C63.2 J8.1 Q3.2(S) Q6.3(D) U6.36(SH_C)
SL_B: Q5.2(S) R50.1 R52.2 U6.39(SL_B)  [also labelled SN1]
SL_C: Q6.2(S) R51.1 R55.2 U6.34(SL_C)  [also labelled SN2]
SPI_MISO: U6.10(SDO) ; port SDO
SPI_MOSI: U6.9(SDI) ; port SDI
SPI_SCK: U6.11(SCLK) ; port SCLK
NetC52_1: C52.1 U6.56(SS_TR)
NetC53_2: C53.2 R36.1 U6.2(COMP)
NetC54_2: C54.2 R36.2
NetC57_1: C57.1 U6.52(BST_BK)
NetC57_2: C57.2 D5.1 L2.1 U6.50(PH) U6.51(PH)
NetC59_1: C59.1 U6.48(BST_A)
NetC60_1: C60.1 U6.43(BST_B)
NetC62_1: C62.1 U6.15(CP2)
NetC62_2: C62.2 U6.14(CP1)
NetC63_1: C63.1 U6.38(BST_C)
NetC64_2: C64.2 U6.23(DVDD)
NetC65_1: C65.1 R52.1 U6.33(SN1)
NetC66_1: C66.1 U6.27(AVDD)
NetC71_1: C71.1 R55.1 U6.31(SN2)
NetD3_1: D3.1 U6.4(PWRGD)
NetD3_2: D3.2 R44.2
NetD4_1: D4.1 U6.5(nOCTW)
NetD4_2: D4.2 R45.2
NetQ1_1: Q1.1(G) R40.1
NetQ2_1: Q2.1(G) R41.1
NetQ3_1: Q3.1(G) R42.1
NetQ4_1: Q4.1(G) R47.1
NetQ5_1: Q5.1(G) R48.1
NetQ6_1: Q6.1(G) R49.1
NetR37_1: R37.1 U6.1(RT_CLK)
NetR38_1: R38.1 R43.2 U6.3(VSENSE)
NetR39_1: R39.1 U6.55(EN_BUCK)
NetR46_2: R46.2 U6.7(DTC)
NetR53_2: R53.2 U6.25(SO1)
NetR54_2: R54.2 U6.26(SO2)

### Notes on the sheet
- (near Q4) SL_A
- (in symbol CAP+) +

### Library data of the parts
C51-C57 C59-C71 = CAP: as C1 on sheet main; Symbol: CAP-0402; Device: cap-0402; LCSC Part Name: 1uF ±10% 10V; Supplier Part: C307414; Supplier Footprint: 0402; JLCPCB Part Class: Extended Part; Datasheet: https://atta.szlcsc.com/upload/public/pdf/source/20181009/C307414_0A02B57115E94FED95F0CB1E32115BFC.pdf; Supplier: LCSC; Convert to PCB: yes
C58 = CAP+: 贴片型铝电解电容，50V; Manufacturer: SAMSUNG(三星); Manufacturer Part: CL05A105KP5NNND; Add into BOM: yes; Tolerance: ±10%; Voltage Rated: 10V; Temperature Coefficient: X5R; Symbol: CAP-0402; Device: cap-0402; LCSC Part Name: 1uF ±10% 10V; Supplier Part: C307414; Supplier Footprint: 0402; JLCPCB Part Class: Extended Part; Datasheet: https://atta.szlcsc.com/upload/public/pdf/source/20181009/C307414_0A02B57115E94FED95F0CB1E32115BFC.pdf; Supplier: LCSC; Convert to PCB: yes
D3 D4 = LED: as D1 on sheet main; Symbol: CAP-0402; Device: cap-0402; LCSC Part Name: 1uF ±10% 10V; Supplier Part: C307414; Supplier Footprint: 0402; JLCPCB Part Class: Extended Part; Datasheet: https://atta.szlcsc.com/upload/public/pdf/source/20181009/C307414_0A02B57115E94FED95F0CB1E32115BFC.pdf; Supplier: LCSC; Convert to PCB: yes
D5 = DIO: 肖特基二极管; Manufacturer: SAMSUNG(三星); Manufacturer Part: CL05A105KP5NNND; Add into BOM: yes; Tolerance: ±10%; Voltage Rated: 10V; Temperature Coefficient: X5R; Symbol: CAP-0402; Device: cap-0402; LCSC Part Name: 1uF ±10% 10V; Supplier Part: C307414; Supplier Footprint: 0402; JLCPCB Part Class: Extended Part; Datasheet: https://atta.szlcsc.com/upload/public/pdf/source/20181009/C307414_0A02B57115E94FED95F0CB1E32115BFC.pdf; Supplier: LCSC; Convert to PCB: yes
J8 = HC-3P-1.0mm: 线对板连接器
L2 = IND: 贴片电感
Q1-Q6 = NMOS: as Q7 on sheet motor1; Device: AO3401A_C306862; LCSC Part Name: P沟道 30V 4.2A; Supplier Part: C306862; Manufacturer Part: AO3401A; Supplier Footprint: SOT-23; JLCPCB Part Class: 扩展库; Datasheet: https://atta.szlcsc.com/upload/public/pdf/source/20190514/C306862_F7EF2FFF49BA48EA0D342955B5285B33.pdf; Supplier: LCSC; Convert to PCB: yes
R34 = NTC: as R1 on sheet main; Symbol: RES-0402; Device: res-0402; LCSC Part Name: 1k ±1%; Supplier Part: C11702; Supplier Footprint: 0402; Datasheet: https://atta.szlcsc.com/upload/public/pdf/source/20200306/C422600_1E6D84923E4A46A82E41ADD87F860B5C.pdf; Supplier: LCSC; Convert to PCB: yes; Type: 厚膜电阻; Operating Temperature Range: -55~+155; JLCPCB Part Class: 基础库
R35-R49 R52-R55 = RES: as R2 on sheet main; Symbol: RES-0402; Device: res-0402; LCSC Part Name: 1k ±1%; Supplier Part: C11702; Supplier Footprint: 0402; Datasheet: https://atta.szlcsc.com/upload/public/pdf/source/20200306/C422600_1E6D84923E4A46A82E41ADD87F860B5C.pdf; Supplier: LCSC; Convert to PCB: yes; Type: 厚膜电阻; Operating Temperature Range: -55~+155; JLCPCB Part Class: 基础库
R50 = RES: 贴片电阻 2512; Manufacturer: UNI-ROYAL(厚声); Manufacturer Part: 0402WGF1001TCE; Add into BOM: yes; Tolerance: ±1%; Power(Watts): 1/16W; Temperature Coefficient: ±100ppm/; Overload Voltage (Max): 50V; Symbol: RES-0402; Device: res-0402; LCSC Part Name: 1k ±1%; Supplier Part: C11702; Supplier Footprint: 0402; Datasheet: https://atta.szlcsc.com/upload/public/pdf/source/20200306/C422600_1E6D84923E4A46A82E41ADD87F860B5C.pdf; Supplier: LCSC; Convert to PCB: yes; Type: 厚膜电阻; Operating Temperature Range: -55~+155; JLCPCB Part Class: 基础库
R51 = RES: 贴片电阻 / 2512; Manufacturer: UNI-ROYAL(厚声); Manufacturer Part: 0402WGF1001TCE; Add into BOM: yes; Tolerance: ±1%; Power(Watts): 1/16W; Temperature Coefficient: ±100ppm/; Overload Voltage (Max): 50V; Symbol: RES-0402; Device: res-0402; LCSC Part Name: 1k ±1%; Supplier Part: C11702; Supplier Footprint: 0402; Datasheet: https://atta.szlcsc.com/upload/public/pdf/source/20200306/C422600_1E6D84923E4A46A82E41ADD87F860B5C.pdf; Supplier: LCSC; Convert to PCB: yes; Type: 厚膜电阻; Operating Temperature Range: -55~+155; JLCPCB Part Class: 基础库
U6 = DRV8301DCAR: 三相电机/栅极驱动IC

## Sheet dc_aux.SchDoc
size A4; SheetNumber: 4; SheetTotal: 4
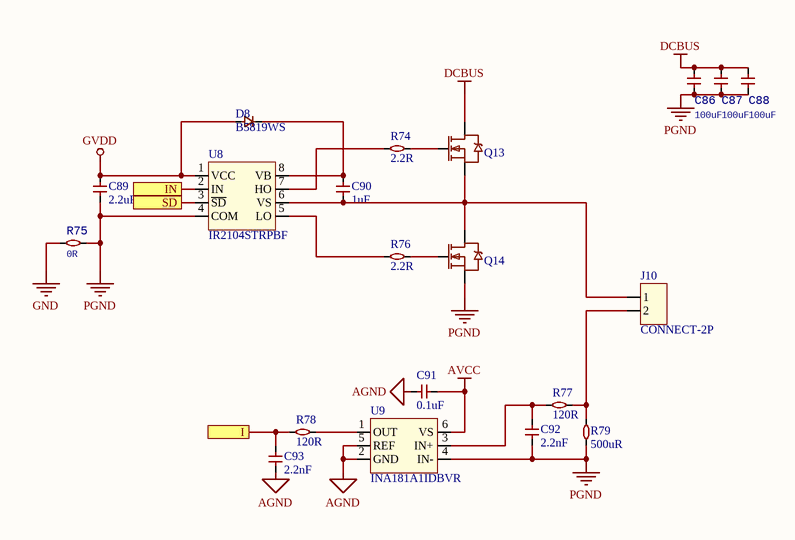
[diagram p3: dc_aux.SchDoc]

### Parts
C86  100uF  [C1206]
C87  100uF  [C1206]
C88  100uF  [C1206]
C89  2.2uF  [C0402]
C90  1uF  [C0402]
C91  0.1uF  [C0402]
C92  2.2nF  [C0402]
C93  2.2nF  [C0402]
D8  B5819WS  [SOD-323]
J10  CONNECT-2P  [CONNECT-2P]
Q13  AP68N06G  [SOT-23-3]  (value not drawn)
Q14  AP68N06G  [SOT-23-3]  (value not drawn)
R74  2.2R  [R0402]
R75  0R  [R0402]
R76  2.2R  [R0402]
R77  120R  [R0402]
R78  120R  [R0402]
R79  500uR  [R2512]
U8  IR2104STRPBF  [SOIC-8]
U9  INA181A1IDBVR  [SOT-23-6]

### Ports
I (see main[8C]), IN (see main[7B]), SD (see main[7C])

### Nets
AGND: C91.1 C93.1 U9.2(GND) U9.5(REF)
AVCC: C91.2 U9.6(VS)
DCBUS: C86.1 C87.1 C88.1 Q13.3(D)
GND: R75.1
GVDD: C89.1 D8.2 U8.1(VCC)
PGND: C86.2 C87.2 C88.2 C89.2 C92.2 Q14.2(S) R75.2 R79.2 U8.4(COM) U9.4(IN-)
AUX_H: U8.3(~{SD}) ; port SD
AUX_I: C93.2 R78.1 ; port I
AUX_L: U8.2(IN) ; port IN
NetC90_1: C90.1 D8.1 U8.8(VB)
NetC90_2: C90.2 J10.1 Q13.2(S) Q14.3(D) U8.6(VS)
NetC92_1: C92.1 R77.1 U9.3(IN+)
NetJ10_2: J10.2 R77.2 R79.1
NetQ13_1: Q13.1(G) R74.2
NetQ14_1: Q14.1(G) R76.2
NetR74_1: R74.1 U8.7(HO)
NetR76_1: R76.1 U8.5(LO)
NetR78_2: R78.2 U9.1(OUT)

### Library data of the parts
C86-C93 = CAP: as C1 on sheet main; Symbol: CAP-0402; Device: cap-0402; LCSC Part Name: 1uF ±10% 10V; Supplier Part: C307414; Supplier Footprint: 0402; JLCPCB Part Class: Extended Part; Datasheet: https://atta.szlcsc.com/upload/public/pdf/source/20181009/C307414_0A02B57115E94FED95F0CB1E32115BFC.pdf; Supplier: LCSC; Convert to PCB: yes
D8 = DIO: 通用二极管; Manufacturer: SAMSUNG(三星); Manufacturer Part: CL05A105KP5NNND; Add into BOM: yes; Tolerance: ±10%; Voltage Rated: 10V; Temperature Coefficient: X5R; Symbol: CAP-0402; Device: cap-0402; LCSC Part Name: 1uF ±10% 10V; Supplier Part: C307414; Supplier Footprint: 0402; JLCPCB Part Class: Extended Part; Datasheet: https://atta.szlcsc.com/upload/public/pdf/source/20181009/C307414_0A02B57115E94FED95F0CB1E32115BFC.pdf; Supplier: LCSC; Convert to PCB: yes
J10 = CONNECT-2P: 连接器
Q13 Q14 = NMOS: as Q7 on sheet motor1; Device: AO3401A_C306862; LCSC Part Name: P沟道 30V 4.2A; Supplier Part: C306862; Manufacturer Part: AO3401A; Supplier Footprint: SOT-23; JLCPCB Part Class: 扩展库; Datasheet: https://atta.szlcsc.com/upload/public/pdf/source/20190514/C306862_F7EF2FFF49BA48EA0D342955B5285B33.pdf; Supplier: LCSC; Convert to PCB: yes
R74 R76 R77 = RES: 贴片电阻0603; Manufacturer: UNI-ROYAL(厚声); Manufacturer Part: 0402WGF1001TCE; Add into BOM: yes; Tolerance: ±1%; Power(Watts): 1/16W; Temperature Coefficient: ±100ppm/; Overload Voltage (Max): 50V; Symbol: RES-0402; Device: res-0402; LCSC Part Name: 1k ±1%; Supplier Part: C11702; Supplier Footprint: 0402; Datasheet: https://atta.szlcsc.com/upload/public/pdf/source/20200306/C422600_1E6D84923E4A46A82E41ADD87F860B5C.pdf; Supplier: LCSC; Convert to PCB: yes; Type: 厚膜电阻; Operating Temperature Range: -55~+155; JLCPCB Part Class: 基础库
R75 R78 = RES: as R2 on sheet main; Symbol: RES-0402; Device: res-0402; LCSC Part Name: 1k ±1%; Supplier Part: C11702; Supplier Footprint: 0402; Datasheet: https://atta.szlcsc.com/upload/public/pdf/source/20200306/C422600_1E6D84923E4A46A82E41ADD87F860B5C.pdf; Supplier: LCSC; Convert to PCB: yes; Type: 厚膜电阻; Operating Temperature Range: -55~+155; JLCPCB Part Class: 基础库
R79 = RES: as R51 on sheet motor0; Symbol: RES-0402; Device: res-0402; LCSC Part Name: 1k ±1%; Supplier Part: C11702; Supplier Footprint: 0402; Datasheet: https://atta.szlcsc.com/upload/public/pdf/source/20200306/C422600_1E6D84923E4A46A82E41ADD87F860B5C.pdf; Supplier: LCSC; Convert to PCB: yes; Type: 厚膜电阻; Operating Temperature Range: -55~+155; JLCPCB Part Class: 基础库
U8 = IR2104STRPBF: 栅极驱动IC / Infineon / SOP-8
U9 = INA181Ax: 电流感应放大器 / TI(德州仪器)

## Nets that join several sheets
5V: main (15 pins), motor0 (5 pins)
AGND: main (7 pins), motor1 (7 pins), motor0 (7 pins), dc_aux (C91.1 C93.1 U9.2 U9.5)
AVCC: main (5 pins), motor1 (R56.2 U7.24), motor0 (R34.2 U6.24), dc_aux (C91.2 U9.6)
DCBUS: main (24 pins), motor1 (6 pins), motor0 (10 pins), dc_aux (C86.1 C87.1 C88.1 Q13.3)
GND: main (61 pins), motor1 (6 pins), motor0 (15 pins), dc_aux (R75.1)
GVDD: motor1 (C75.2 U7.13), motor0 (C61.2 U6.13), dc_aux (C89.1 D8.2 U8.1)
PGND: main (24 pins), motor1 (8 pins), motor0 (8 pins), dc_aux (10 pins)
VCC: main (19 pins), motor1 (R62.1 R63.1 U7.49), motor0 (U6.49)
AUX_H: main (U1.30), dc_aux (U8.3)
AUX_I: main (U1.21), dc_aux (C93.2 R78.1)
AUX_L: main (U1.29), dc_aux (U8.2)
EN_GATE: main (U1.33), motor1 (U7.16), motor0 (U6.16)
M0_AH: main (U1.41), motor0 (U6.17)
M0_AL: main (U1.34), motor0 (U6.18)
M0_BH: main (U1.42), motor0 (U6.19)
M0_BL: main (U1.35), motor0 (U6.20)
M0_CH: main (U1.43), motor0 (U6.21)
M0_CL: main (U1.36), motor0 (U6.22)
M0_CS: main (U1.2), motor0 (U6.8)
M0_DC_CAL: main (U1.40), motor0 (U6.12)
M0_SO1: main (U1.8), motor0 (C67.1 R53.1)
M0_SO2: main (U1.9), motor0 (C68.1 R54.1)
M0_TEMP: main (U1.25), motor0 (C51.1 R34.1 R35.2)
M1_AH: main (U1.37), motor1 (U7.17)
M1_AL: main (U1.23), motor1 (U7.18)
M1_BH: main (U1.38), motor1 (U7.19)
M1_BL: main (U1.26), motor1 (U7.20)
M1_CH: main (U1.39), motor1 (U7.21)
M1_CL: main (U1.27), motor1 (U7.22)
M1_CS: main (U1.3), motor1 (U7.8)
M1_DC_CAL: main (U1.4), motor1 (U7.12)
M1_SO1: main (U1.11), motor1 (C81.1 R71.1)
M1_SO2: main (U1.10), motor1 (C82.1 R72.1)
M1_TEMP: main (U1.20), motor1 (C72.1 R56.1 R57.2)
nFAULT: main (U1.54), motor1 (U7.6), motor0 (U6.6)
SPI_MISO: main (U1.52), motor1 (U7.10), motor0 (U6.10)
SPI_MOSI: main (U1.53), motor1 (U7.9), motor0 (U6.9)
SPI_SCK: main (U1.51), motor1 (U7.11), motor0 (U6.11)